# EAGLE design Esp_Companion_V1 (EAGLE 7.2.0)
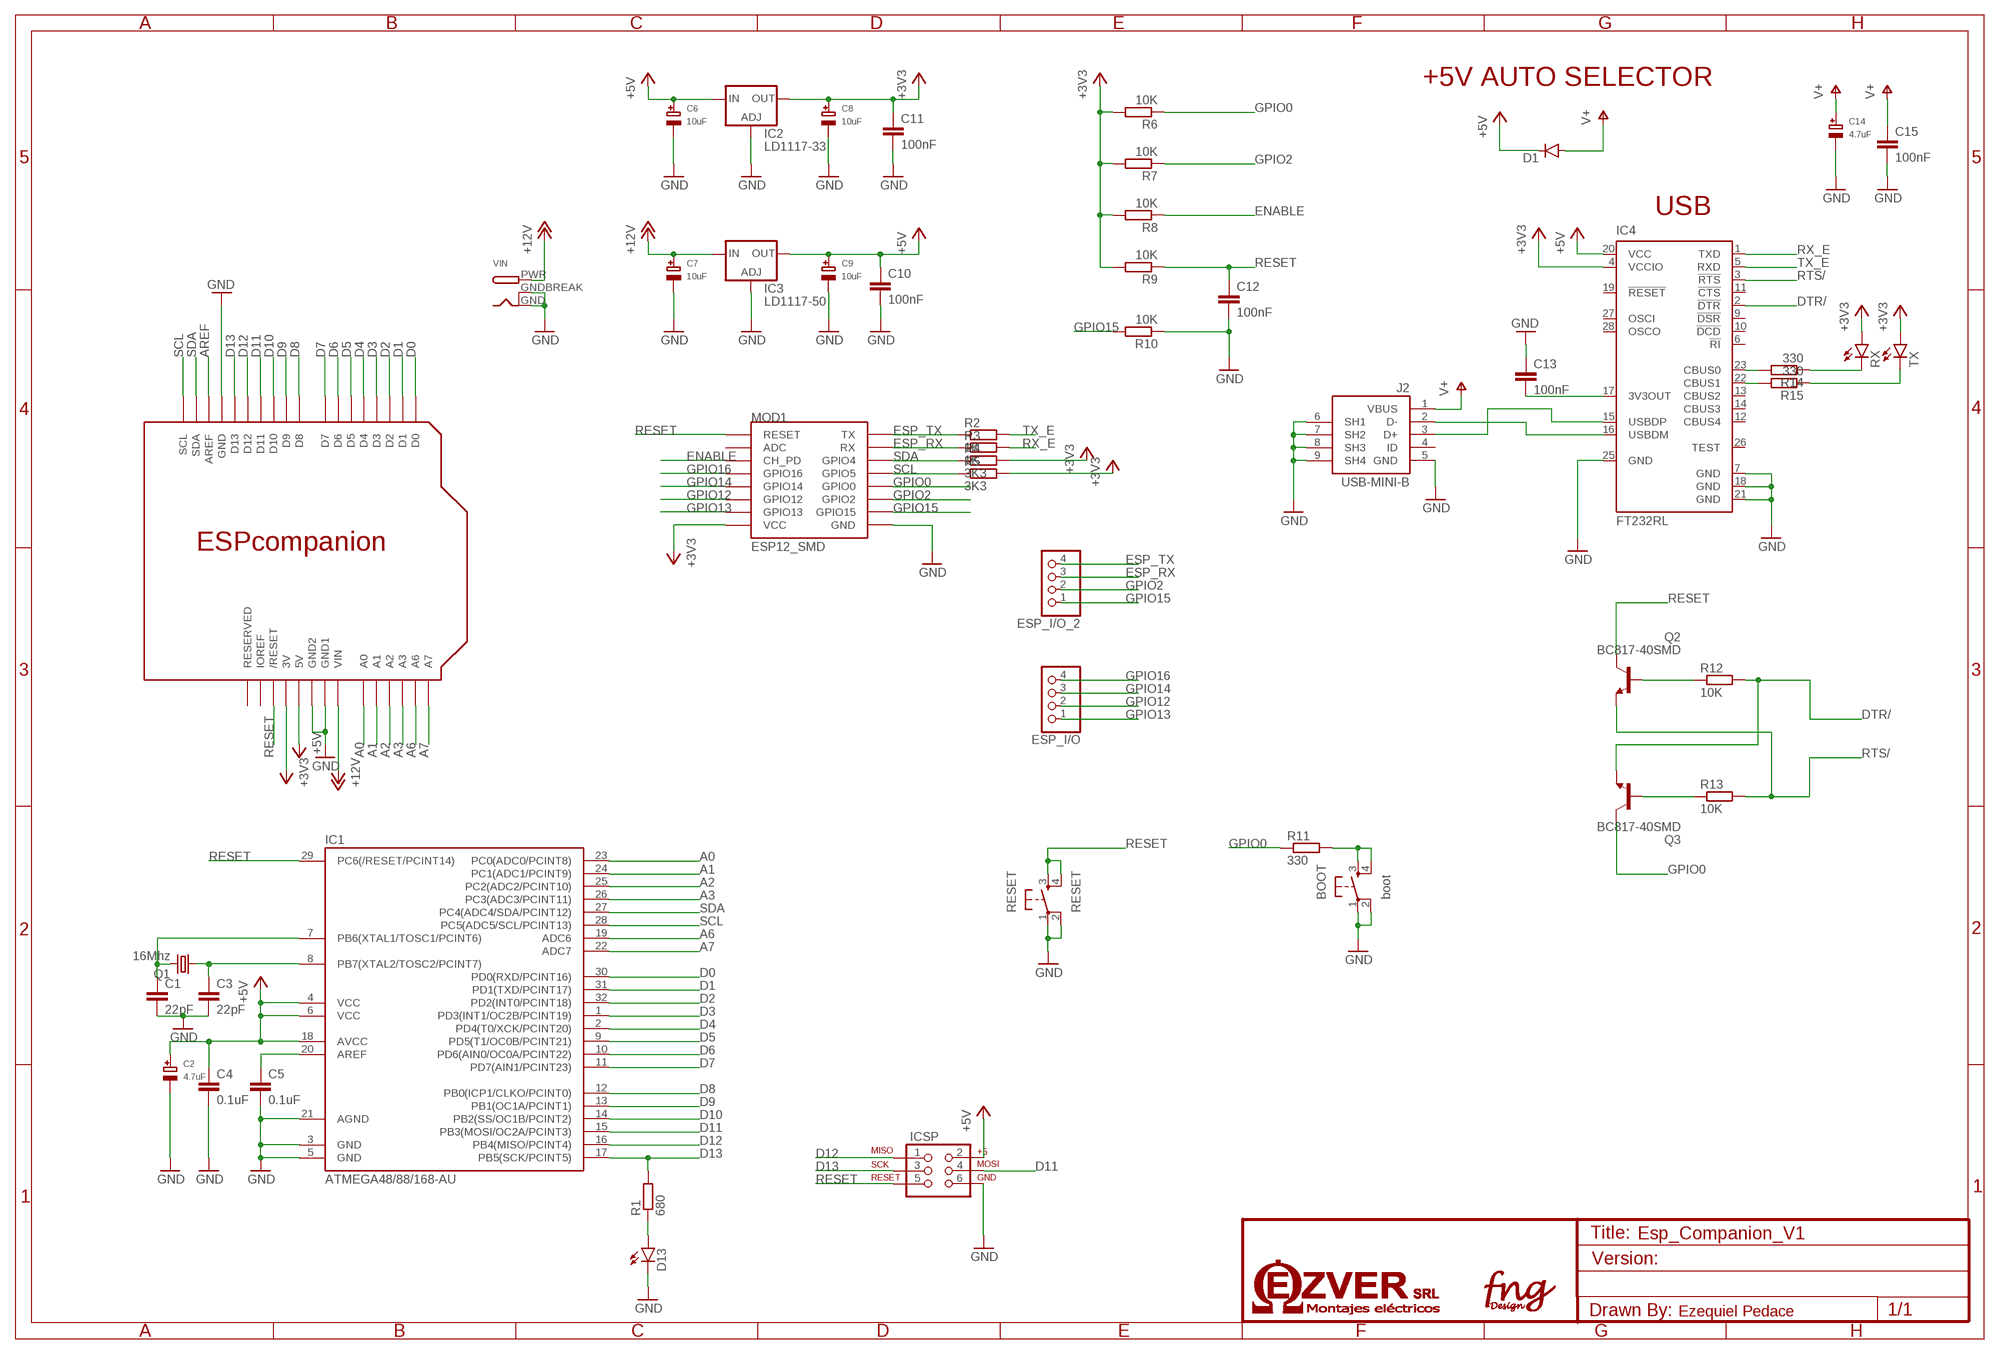
[diagram p0: schematic, sheet 1]

## Parts
BOOT  boot  TAC_SWITCHPTH  [TACTILE-PTH]
C1  22pF  C-EUC0603  [C0603]
C2  4.7uF  CAP_TANTALUMA/3216_REFLOW  [EIA3216-18/A-R]
C3  22pF  C-EUC0603  [C0603]
C4  0.1uF  C-EUC0603  [C0603]
C5  0.1uF  C-EUC0603  [C0603]
C6  10uF  CAP_TANTALUMA/3216_REFLOW  [EIA3216-18/A-R]
C7  10uF  CAP_TANTALUMA/3216_REFLOW  [EIA3216-18/A-R]
C8  10uF  CAP_TANTALUMA/3216_REFLOW  [EIA3216-18/A-R]
C9  10uF  CAP_TANTALUMA/3216_REFLOW  [EIA3216-18/A-R]
C10  100nF  C-EUC0603  [C0603]
C11  100nF  C-EUC0603  [C0603]
C12  100nF  C-EUC0603  [C0603]
C13  100nF  C-EUC0603  [C0603]
C14  4.7uF  CAP_TANTALUMA/3216_REFLOW  [EIA3216-18/A-R]
C15  100nF  C-EUC0603  [C0603]
D1  DIODESMA-ALT  [SMA-DIODE_ALT]
D13  LED-FKIT-1206  [FKIT-LED-1206]
ESP_I/O  PINHD-1X4  [1X04]
ESP_I/O_2  PINHD-1X4  [1X04]
IC1  ATMEGA48/88/168-AU  [TQFP32-08]
IC2  LD1117-33  LD117ADT33TR  [DPACK]
IC3  LD1117-50  LD117ADT33TR  [DPACK]
IC4  FT232RL  [SSOP28]
ICSP  AVR_SPI_PRG_62X3_LOCK  [2X3_LOCK]
J2  USB-MINI-B  [USB-MINI-B]
LAY1  ESPCOMPANIONHOLES  [ESPCOMPANION_HOLES]
MOD1  ESP12_SMD  [ESP12_SMD]
Q1  16Mhz  CRYSTALHC49U70  [HC49U70]
Q2  BC817-40SMD  [SOT23-BEC]
Q3  BC817-40SMD  [SOT23-BEC]
R1  680  R-EU_R0603  [R0603]
R2  1K  R-EU_R0603  [R0603]
R3  1K  R-EU_R0603  [R0603]
R4  3K3  R-EU_R0603  [R0603]
R5  3K3  R-EU_R0603  [R0603]
R6  10K  R-EU_R0603  [R0603]
R7  10K  R-EU_R0603  [R0603]
R8  10K  R-EU_R0603  [R0603]
R9  10K  R-EU_R0603  [R0603]
R10  10K  R-EU_R0603  [R0603]
R11  330  R-EU_R0603  [R0603]
R12  10K  R-EU_R0603  [R0603]
R13  10K  R-EU_R0603  [R0603]
R14  330  R-EU_R0603  [R0603]
R15  330  R-EU_R0603  [R0603]
RESET  RESET  TAC_SWITCHPTH  [TACTILE-PTH]
RX  LED-FKIT-1206  [FKIT-LED-1206]
TX  LED-FKIT-1206  [FKIT-LED-1206]
VIN  DCBARRELPTH  [DCJACK_2MM_PTH]

## Nets
+3V3: C8.+ C11.1 IC2.4(OUT) IC4.4(VCCIO) LAY1.3V MOD1.P$8(VCC) R4.2 R5.2 R6.2 R7.2 R8.2 R9.2 RX.A TX.A
+5V: C2.+ C4.1 C6.+ C9.+ C10.1 D1.C IC1.4(VCC) IC1.6(VCC) IC1.18(AVCC) IC2.3(IN) IC3.4(OUT) IC4.20(VCC) ICSP.2 LAY1.5V
+12V: C7.+ IC3.3(IN) LAY1.VIN VIN.PWR
A0: IC1.23(PC0(ADC0/PCINT8)) LAY1.A0
A1: IC1.24(PC1(ADC1/PCINT9)) LAY1.A1
A2: IC1.25(PC2(ADC2/PCINT10)) LAY1.A2
A3: IC1.26(PC3(ADC3/PCINT11)) LAY1.A3
A6: IC1.19(ADC6) LAY1.A6
A7: IC1.22(ADC7) LAY1.A7
AREF: LAY1.AREF
D0: IC1.30(PD0(RXD/PCINT16)) LAY1.D0
D1: IC1.31(PD1(TXD/PCINT17)) LAY1.D1
D2: IC1.32(PD2(INT0/PCINT18)) LAY1.D2
D3: IC1.1(PD3(INT1/OC2B/PCINT19)) LAY1.D3
D4: IC1.2(PD4(T0/XCK/PCINT20)) LAY1.D4
D5: IC1.9(PD5(T1/OC0B/PCINT21)) LAY1.D5
D6: IC1.10(PD6(AIN0/OC0A/PCINT22)) LAY1.D6
D7: IC1.11(PD7(AIN1/PCINT23)) LAY1.D7
D8: IC1.12(PB0(ICP1/CLKO/PCINT0)) LAY1.D8
D9: IC1.13(PB1(OC1A/PCINT1)) LAY1.D9
D10: IC1.14(PB2(SS/OC1B/PCINT2)) LAY1.D10
D11: IC1.15(PB3(MOSI/OC2A/PCINT3)) ICSP.4 LAY1.D11
D12: IC1.16(PB4(MISO/PCINT4)) ICSP.1 LAY1.D12
D13: IC1.17(PB5(SCK/PCINT5)) ICSP.3 LAY1.D13 R1.2
DTR/: IC4.2(!DTR) Q3.E R12.2
ENABLE: MOD1.P$3(CH_PD) R8.1
ESP_RX: ESP_I/O_2.3 MOD1.P$15(RX) R3.1
ESP_TX: ESP_I/O_2.4 MOD1.P$16(TX) R2.1
GND: BOOT.1 BOOT.2 C1.2 C2.- C3.2 C4.2 C5.2 C6.- C7.- C8.- C9.- C10.2 C11.2 C12.2 C13.1 C14.- C15.2 D13.C IC1.3(GND) IC1.5(GND) IC1.21(AGND) IC2.1(ADJ) IC3.1(ADJ) IC4.7(GND) IC4.18(GND) IC4.21(GND) IC4.25(GND) ICSP.6 J2.5(GND) J2.6(SH1) J2.7(SH2) J2.8(SH3) J2.9(SH4) LAY1.GND LAY1.GND1 LAY1.GND2 MOD1.P$9(GND) R10.1 RESET.1 RESET.2 VIN.GND VIN.GNDBREAK
GPIO0: MOD1.P$12(GPIO0) Q3.C R6.1 R11.1
GPIO2: ESP_I/O_2.2 MOD1.P$11(GPIO2) R7.1
GPIO12: ESP_I/O.2 MOD1.P$6(GPIO12)
GPIO13: ESP_I/O.1 MOD1.P$7(GPIO13)
GPIO14: ESP_I/O.3 MOD1.P$5(GPIO14)
GPIO15: ESP_I/O_2.1 MOD1.P$10(GPIO15) R10.2
GPIO16: ESP_I/O.4 MOD1.P$4(GPIO16)
N$1: D13.A R1.1
N$2: BOOT.3 BOOT.4 R11.2
N$3: Q2.B R12.1
N$4: Q3.B R13.1
N$25: C3.1 IC1.8(PB7(XTAL2/TOSC2/PCINT7)) Q1.1
N$28: C1.1 IC1.7(PB6(XTAL1/TOSC1/PCINT6)) Q1.2
N$29: C5.1 IC1.20(AREF)
N$40: C13.2 IC4.17(3V3OUT)
N$42: IC4.23(CBUS0) R14.2
N$43: IC4.22(CBUS1) R15.2
N$44: R15.1 TX.C
N$45: R14.1 RX.C
N$46: IC4.16(USBDM) J2.2(D-)
N$47: IC4.15(USBDP) J2.3(D+)
RESET: C12.1 IC1.29(PC6(/RESET/PCINT14)) ICSP.5 LAY1.RESET(/RESET) MOD1.P$1(RESET) Q2.C R9.1 RESET.3 RESET.4
RTS/: IC4.3(!RTS) Q2.E R13.2
RX_E: IC4.1(TXD) R3.2
SCL: IC1.28(PC5(ADC5/SCL/PCINT13)) LAY1.SCL MOD1.P$14(GPIO5) R5.1
SDA: IC1.27(PC4(ADC4/SDA/PCINT12)) LAY1.SDA MOD1.P$13(GPIO4) R4.1
TX_E: IC4.5(RXD) R2.2
V+: C14.+ C15.1 D1.A J2.1(VBUS)
Unconnected: IC4.6(!RI) IC4.9(!DSR) IC4.10(!DCD) IC4.11(!CTS) IC4.12(CBUS4) IC4.13(CBUS2) IC4.14(CBUS3) IC4.19(!RESET) IC4.26(TEST) IC4.27(OSCI) IC4.28(OSCO) J2.4(ID) LAY1.IOREF LAY1.RESERVED MOD1.P$2(ADC)

## Notes on the sheet
- +5V AUTO SELECTOR
- USB

## Library data of the parts
BOOT RESET = SparkFun-Electromechanical:TAC_SWITCH: Momentary Switch Button commonly used for reset or general input. Spark Fun Electronics SKU : COM-00097
C1 C3-C5 C10-C13 C15 = rcl:C-EU: CAPACITOR, European symbol
C2 C6-C9 C14 = microbuilder:CAP_TANTALUM: Tantalum Capacitors Wave footprints have larger pads and are meant to be used for hand soldering. Reflow footprints are optimised for solder paste and a reflow oven. EIA3216-18/A-[R/W] - Size A / 3216-18 / 1206 footprint 4.7µF 25V 10% Tantalum Capacitor 10µF 16V 10% Tantalum Capacitor [Digikey: 495-2236-2-ND] EIA3528-21/B-[R/W] - Size B / 3528-21 47µF 10V 10% Tantalum Capactior [Digikey: 495-2216-1-ND] EIA6032-28/C-[R/W] - Size C / 6032-28 10µF 35V 20% Tantalum Capacitor [Digikey: 495-2285-1-ND] 100µF 16V 10% Tantalum Capactior [Digikey: 399-5214-1-ND]
D1 = SparkFun-DiscreteSemi:DIODE: Diode These are standard reverse protection diodes and small signal diodes. SMA package can handle up to about 1A. SOD-323 can handle about 200mA. What the SOD-323 package when ordering, there are some mfgs out there that are 5-pin packages.
D13 RX TX = SparkFun-LED:LED: LEDs Standard schematic elements and footprints for 5mm, 3mm, 1206, and 0603 sized LEDs. 5mm - Spark Fun Electronics SKU : COM-00529 (and others)
ESP_I/O ESP_I/O_2 = pinhead:PINHD-1X4: PIN HEADER
IC1 = atmega8:ATMEGA48/88/168
IC2 IC3 = v-reg:LD117A?*: Low drop fixed and adjustable positive voltage regulators 1 A Source: http://www.st.com/stonline/products/literature/ds/7194/ld1117axx.pdf
IC4 = ftdichip:FT232R: Source: http://www.ftdichip.com/Documents/DataSheets/DS_FT232R_v104.pdf; MPN: FT232RL; OC_FARNELL: 1146032; OC_NEWARK: 91K9918
ICSP = SparkFun-Connectors:AVR_SPI_PRG_6: AVR ISP 6 Pin This is the reduced ISP connector for AVR programming. Common on Arduino. This footprint will take up less PCB space and can be used with a 10-pin to 6-pin adapter such as SKU: BOB-08508 **Special note about "TEST_POINT" package. The stop mask is on the top side, so if you want your programming test points to be on the bottom of your board, make sure to place this package on the bottom side of the board. This also ensure that the orientation to program from the bottom side will be correct.
J2 = MyCON:USB-MINI-B
LAY1 = fng:ESPCOMPANION
MOD1 = esp8266modules:ESP12_SMD
Q1 = crystal:CRYSTAL: CRYSTAL; OC_FARNELL: unknown; OC_NEWARK: unknown
Q2 Q3 = transistor-npn:BC817*: NPN Transistor
R1-R15 = rcl:R-EU_: RESISTOR, European symbol
VIN = adafruit:DCBARREL: 2.0mm DC Barrel Jack DCJACK_2MM_PTH - Through Hole Jack (4UConnector: 05537)

## Board
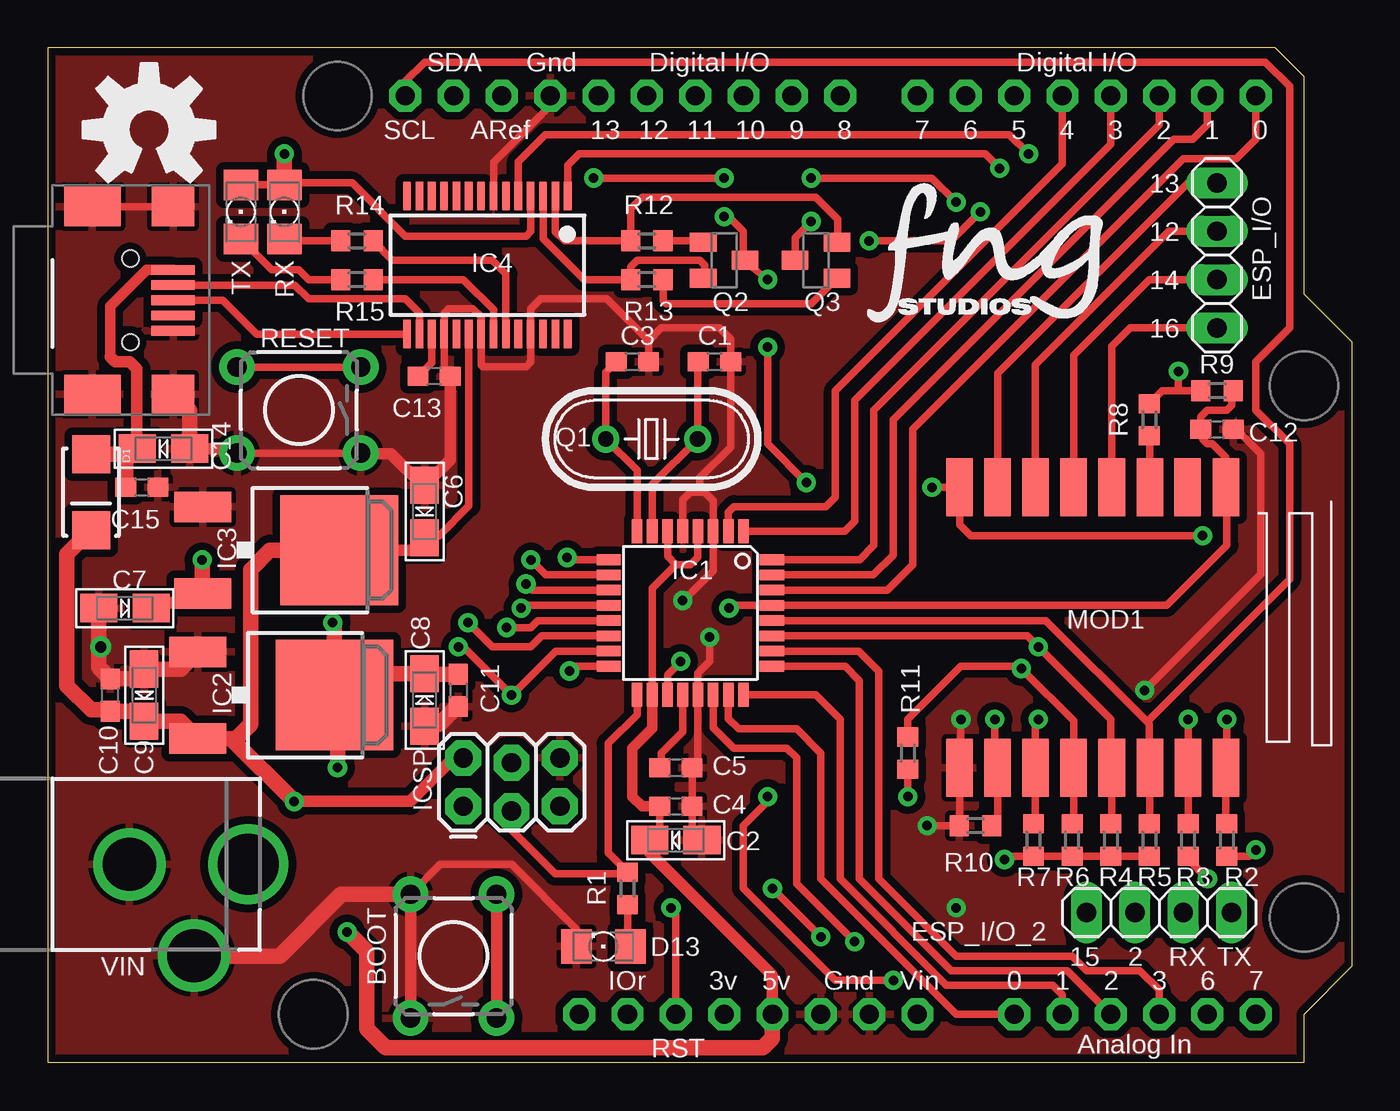
[diagram p1: board, top side]
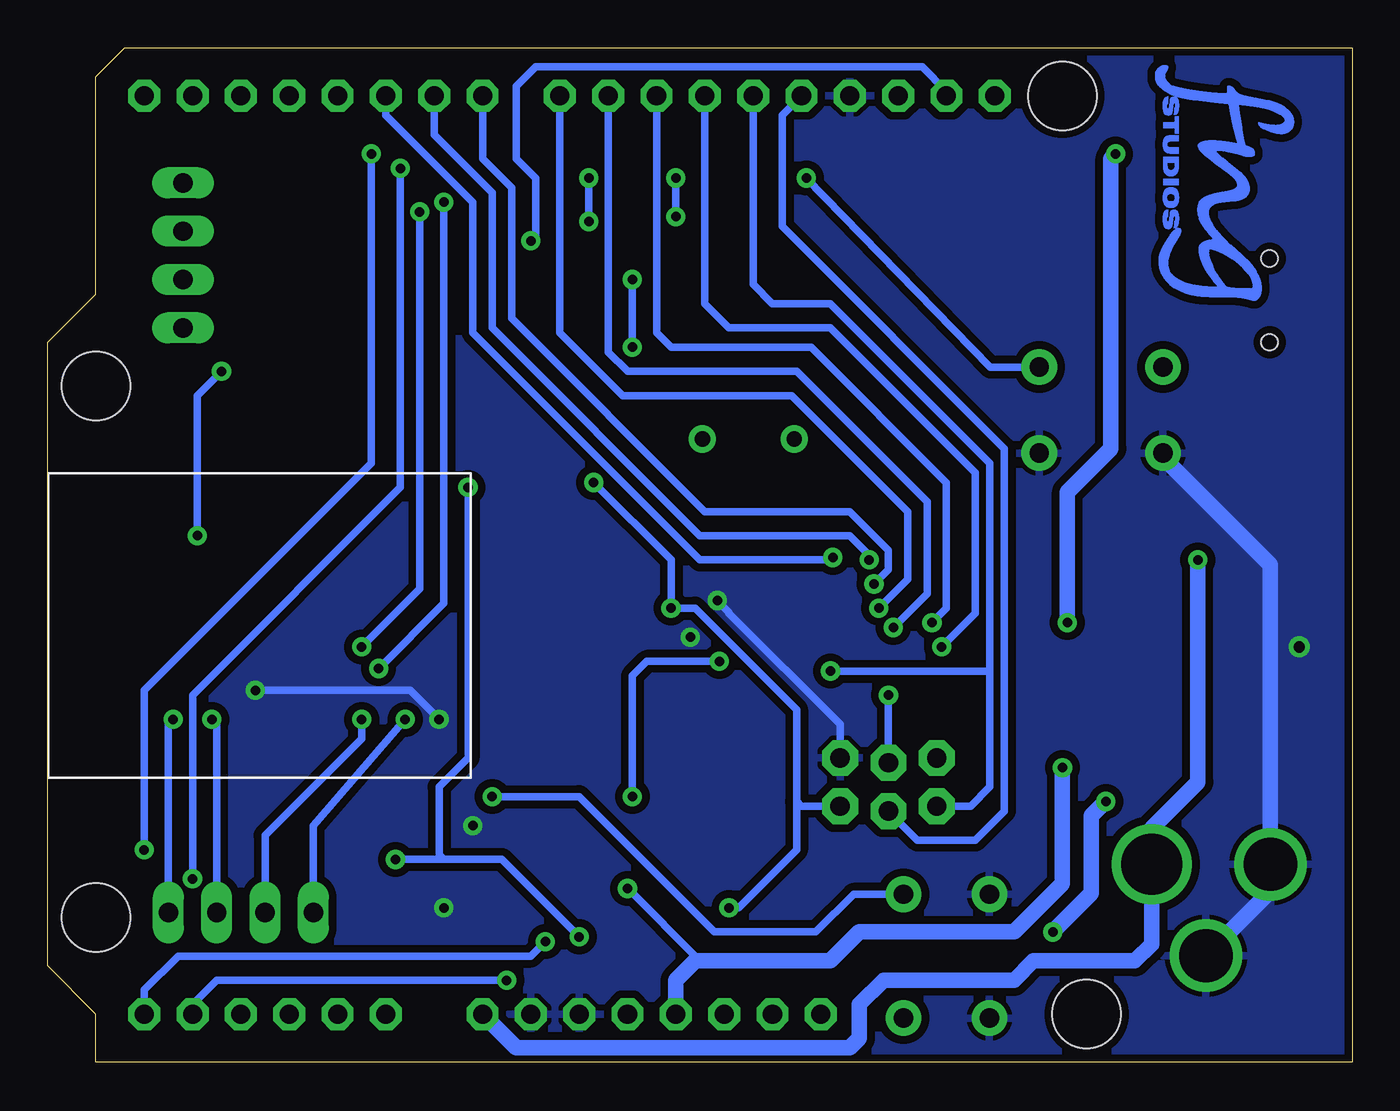
[diagram p2: board, bottom side, seen from below]

Size 68.58 x 53.34 mm. Coordinates in mm from the lower left corner, seen from the top.
Copper layers (1*16): Top 0.035mm / dielectric 1.5mm / Bottom 0.035mm
Design rules "SparkFun": minimum track width 8mil, minimum drill 20mil, track to track 8mil, track to pad 8mil, pad to pad 8mil, via to via 8mil, smd to smd 8mil, copper to edge 10mil, drill to drill 8mil, minimum pad ring 12mil, minimum via ring 10mil, stop-mask expansion 4mil, vias tented up to drill 25mil, thermal gap 10mil

### Footprints (pad centres in the part's own frame; a part is rotated, then mirrored left to right if it is on the bottom)
TACTILE-PTH = drill 1.016 pad 1.88: 1 -3.251,2.261; 2 3.251,2.261; 3 -3.251,-2.261; 4 3.251,-2.261
C0603 = smd 1.1 x 1: 1 -0.85,0; 2 0.85,0
EIA3216-18/A-R = smd 1.95 x 1.5: + 1.375,0; - -1.375,0
SMA-DIODE_ALT = smd 2 x 2: A -2,0; C 2,0
FKIT-LED-1206 = smd 1.6 x 1.803: A -1.422,0; C 1.422,0
1X04 = drill 1.016 long: 1 -3.81,0; 2 -1.27,0; 3 1.27,0; 4 3.81,0
TQFP32-08 = smd 1.27 x 0.559: 1 -4.293,2.8; 2 -4.293,2; 3 -4.293,1.2; 4 -4.293,0.4; 5 -4.293,-0.4; 6 -4.293,-1.2; 7 -4.293,-2; 8 -4.293,-2.8; 17 4.293,-2.8; 18 4.293,-2; 19 4.293,-1.2; 20 4.293,-0.4; 21 4.293,0.4; 22 4.293,1.2; 23 4.293,2; 24 4.293,2.8 | smd 0.559 x 1.27: 9 -2.8,-4.293; 10 -2,-4.293; 11 -1.2,-4.293; 12 -0.4,-4.293; 13 0.4,-4.293; 14 1.2,-4.293; 15 2,-4.293; 16 2.8,-4.293; 25 2.8,4.293; 26 2,4.293; 27 1.2,4.293; 28 0.4,4.293; 29 -0.4,4.293; 30 -1.2,4.293; 31 -2,4.293; 32 -2.8,4.293
DPACK = smd 1.6 x 3: 1 -2.28,-4.8; 3 2.28,-4.8 | smd 5.8 x 6.2: 4 0,2.38
SSOP28 = smd 0.4 x 1.5: 1 -4.225,-3.625; 2 -3.575,-3.625; 3 -2.925,-3.625; 4 -2.275,-3.625; 5 -1.625,-3.625; 6 -0.975,-3.625; 7 -0.325,-3.625; 8 0.325,-3.625; 9 0.975,-3.625; 10 1.625,-3.625; 11 2.275,-3.625; 12 2.925,-3.625; 13 3.575,-3.625; 14 4.225,-3.625; 15 4.225,3.625; 16 3.575,3.625; 17 2.925,3.625; 18 2.275,3.625; 19 1.625,3.625; 20 0.975,3.625; 21 0.325,3.625; 22 -0.325,3.625; 23 -0.975,3.625; 24 -1.625,3.625; 25 -2.275,3.625; 26 -2.925,3.625; 27 -3.575,3.625; 28 -4.225,3.625
2X3_LOCK = drill 1.016 pad 1.88 octagon: 1 0,0; 2 0,2.54; 3 2.54,-0.254; 4 2.54,2.286; 5 5.08,0; 6 5.08,2.54
USB-MINI-B = smd 0.508 x 2.286: 1 0,0; 2 0.8,0; 3 1.6,0; 4 2.4,0; 5 3.2,0 | smd 2.057 x 2.235: 6 -3.328,0; 7 6.529,0 | smd 2.057 x 2.972: 8 -3.328,-4.25; 9 6.529,-4.25 | hole 0.864: -0.6,-2.25; 3.8,-2.25
ESPCOMPANION_HOLES = drill 1 pad 1.676 octagon: 3V 1.27,-24.13; 5V 3.81,-24.13; A0 16.51,-24.13; A1 19.05,-24.13; A2 21.59,-24.13; A3 24.13,-24.13; A6 26.67,-24.13; A7 29.21,-24.13; AREF -10.414,24.13; D0 29.21,24.13; D1 26.67,24.13; D2 24.13,24.13; D3 21.59,24.13; D4 19.05,24.13; D5 16.51,24.13; D6 13.97,24.13; D7 11.43,24.13; D8 7.366,24.13; D9 4.826,24.13; D10 2.286,24.13; D11 -0.254,24.13; D12 -2.794,24.13; D13 -5.334,24.13; GND -7.874,24.13; GND1 8.89,-24.13; GND2 6.35,-24.13; IOREF -3.81,-24.13; RESERVED -6.35,-24.13; RESET -1.27,-24.13; SCL -15.494,24.13; SDA -12.954,24.13; VIN 11.43,-24.13 | hole 3.6: -19.05,24.13; 31.75,8.89; 31.75,-19.05; -20.32,-24.13
ESP12_SMD = smd 3.048 x 1.397: P$1 -7.366,7.061; P$2 -7.366,5.055; P$3 -7.366,3.073; P$4 -7.366,1.067; P$5 -7.366,-0.94; P$6 -7.366,-2.946; P$7 -7.366,-4.928; P$8 -7.366,-6.934; P$9 7.366,-6.934; P$10 7.366,-4.928; P$11 7.366,-2.946; P$12 7.366,-0.94; P$13 7.366,1.067; P$14 7.366,3.073; P$15 7.366,5.08; P$16 7.366,7.061
HC49U70 = drill 0.813: 1 -2.413,0; 2 2.413,0
SOT23-BEC = smd 1 x 1.4: B -0.95,-1.1; C 0,1.1; E 0.95,-1.1
R0603 = smd 1 x 1.1: 1 -0.85,0; 2 0.85,0
DCJACK_2MM_PTH = drill 2.8: GND 0,7.35; GNDBREAK 4.8,10.75 | drill 3.2: PWR 0,13.6

### Placement (x,y rotation side)
BOOT  21.34,5.59 90 top
C1  35.05,36.83 0 top
C2  33.02,11.68 180 top
C3  30.73,36.83 0 top
C4  33.02,13.46 0 top
C5  33.02,15.49 0 top
C6  19.81,28.96 270 top
C7  4.06,23.88 0 top
C8  19.81,19.05 90 top
C9  5.08,19.3 270 top
C10  3.3,19.3 90 top
C11  21.59,19.56 270 top
C12  61.47,33.27 0 top
C13  20.32,36.07 180 top
C14  6.1,32.26 180 top
C15  4.95,30.23 0 top
D1  2.29,29.97 270 top
D13  29.21,6.1 180 top
ESP_I/O  61.47,42.42 270 top
ESP_I/O_2  58.42,7.87 0 top
IC1  33.78,23.62 270 top
IC2  12.7,19.3 270 top
IC3  12.95,26.92 270 top
IC4  23.11,41.91 180 top
ICSP  21.84,13.46 0 top
J2  6.6,41.66 270 top
LAY1  34.29,26.67 0 top
MOD1  54.86,22.86 270 top
Q1  31.75,32.77 0 top
Q2  35.56,42.16 270 top
Q3  40.39,42.16 90 top
R1  30.48,9.14 90 top
R2  61.98,11.68 270 top
R3  59.94,11.68 270 top
R4  55.88,11.68 270 top
R5  57.91,11.68 270 top
R6  53.85,11.68 270 top
R7  51.82,11.68 270 top
R8  57.91,33.78 90 top
R9  61.47,35.31 180 top
R10  48.77,12.45 0 top
R11  45.21,16.26 270 top
R12  31.5,43.18 180 top
R13  31.5,41.15 180 top
R14  16.26,43.18 0 top
R15  16.26,41.15 0 top
RESET  13.21,34.29 180 top
RX  12.45,44.7 270 top
TX  10.16,44.7 270 top
U$2  [LOGOFNGNAME1]  42.42,37.85 0 top
U$3  [LOGOFNG]  11.43,53.09 270 bottom
U$4  [OSHW-LOGO-L]  5.33,49.02 0 top
VIN  -3.05,10.41 270 top

### Tracks (layer width: path | path; a pad name or v marks a point on that pad's centre or on a via)
+3V3  (via drill 0.5)
  Top 0.406: R7.2 R6.2 R4.2 R5.2 50.46,10.83 v50.29,10.67 | TX.A RX.A 12.55,46.23 16,46.23 18.8,43.43 25.15,43.43 25.39,43.68 IC4.4 | R9.2 59.44,35.31 | 59.44,35.31 58.59,35.31 R8.2 | v60.71,27.69 48.51,27.69 47.93,28.27 MOD1.P$8 v46.48,30.23 | v59.44,36.32 59.44,35.31 | 19.81,21.08 C8.+ | 15.95,20.43 IC2.4 15.24,19.72 | v40.64,6.6 v38.1,9.14
  Top 0.813: 15.24,19.72 v15.24,15.49 | 15.95,20.43 C8.+ 19.83,20.41 C11.1 | IC2.4 15.08,22.77 v14.99,23.11 | v12.45,47.75 RX.A
  Bottom 0.406: v60.71,27.69 60.71,35.05 v59.44,36.32 | v50.29,10.67 47.75,10.67 | 47.75,10.67 44.7,10.67 v40.64,6.6 | v38.1,9.14 34.29,5.33 | v46.48,30.23 46.48,16 48.01,14.48 48.01,10.92 47.75,10.67
  Bottom 0.813: v15.24,15.49 15.24,9.4 17.78,6.86 25.91,6.86 27.43,5.33 34.29,5.33 34.54,5.33 35.56,4.32 LAY1.3V | v14.99,23.11 14.99,29.97 12.7,32.26 12.7,47.5 v12.45,47.75
+5V  (via drill 0.5)
  Top 0.406: C4.1 32.17,12.21 C2.+ | IC4.20 22.14,29.25 20.57,27.69 19.92,27.69 C6.+ | IC1.6 32.58,26.6 33.02,26.16 | IC1.4 34.18,26.56 33.78,26.16 33.02,26.16 | IC1.18 31.78,24.92 33.02,26.16
  Top 0.559: IC1.18 31.78,17.56 30.73,16.51 30.73,13.97 31.24,13.46 C4.1
  Top 0.61: IC3.4 19.16,26.92 C6.+ | ICSP.2 21.34,16 19.05,13.72 v12.96,13.72 | C2.+ 31.64,11.03 38.1,4.57 LAY1.5V
  Top 0.813: 9.65,17.02 IC2.3 7,17.93 C9.+ 4.55,18.45 C10.1 3.21,18.54 2.29,18.54 1.02,19.81 1.02,26.7 D1.C | 9.65,17.02 9.91,17.02 10.67,17.78 10.67,25.91 11.68,26.92 IC3.4 | LAY1.5V 38.1,1.27 37.59,0.76 17.78,0.76 16.76,1.78 16.76,5.84 v15.75,6.86 | v12.96,13.72 9.65,17.02
  Bottom 0.813: v15.75,6.86 13.72,8.89 13.72,12.96 v12.96,13.72
+12V  (via drill 0.5)
  Top 0.61: IC3.3 C7.+
  Top 0.813: v8.13,26.42 8.13,24.67 IC3.3
  Bottom 0.813: LAY1.VIN 43.94,0.76 26.42,0.76 25.91,1.27 25.91,3.05 24.64,4.32 17.78,4.32 16.76,5.33 11.43,5.33 10.55,6.21 VIN.PWR 10.55,12.31 8.13,14.73 v8.13,26.42
A0
  Top 0.406: IC1.23 35.78,18.07 36.32,17.53 39.37,17.53 40.64,16.26 40.64,9.65 47.75,2.54 LAY1.A0
A1
  Top 0.406: IC1.24 40.36,19.33 41.66,18.03 41.66,9.65 47.24,4.06 52.83,4.06 53.34,3.56 LAY1.A1
A2
  Top 0.406: IC1.25 41.92,20.82 42.67,20.07 42.67,9.65 47.5,4.83 53.59,4.83 LAY1.A2
A3
  Top 0.406: IC1.26 42.64,21.62 43.69,20.57 43.69,9.65 47.75,5.59 53.85,5.59 54.61,4.83 57.4,4.83 58.42,3.81 LAY1.A3
A6  (via drill 0.5)
  Top 0.406: IC1.19 32.58,20.39 v33.27,21.08 | v37.85,13.97 37.85,13.72 36.58,12.45 36.58,9.14 41.4,4.32 v44.45,4.32
  Bottom 0.406: v33.27,21.08 37.08,21.08 37.85,20.32 v37.85,13.97 | LAY1.A6 60.96,3.05 59.69,4.32 v44.45,4.32
A7  (via drill 0.5)
  Top 0.406: IC1.22 34.98,17.6 36.07,16.51 38.86,16.51 39.37,16 39.37,9.4 v42.42,6.35
  Bottom 0.406: LAY1.A7 63.5,3.81 61.72,5.59 43.18,5.59 v42.42,6.35
D0
  Top 0.406: IC1.30 44.13,24.82 45.47,26.16 45.47,33.27 59.69,47.5 62.48,47.5 63.5,48.51 LAY1.D0
D1
  Top 0.406: IC1.31 43.4,25.62 44.45,26.67 44.45,33.78 59.18,48.51 60.2,48.51 60.96,49.28 LAY1.D1
D2
  Top 0.406: IC1.32 42.68,26.42 43.43,27.18 43.43,34.29 58.42,49.28 LAY1.D2
D3
  Top 0.406: IC1.1 41.88,27.91 42.42,28.45 42.42,34.8 55.88,48.26 LAY1.D3
D4
  Top 0.406: IC1.2 35.78,28.92 36.07,29.21 40.89,29.21 41.4,29.72 41.4,35.31 53.34,47.24 LAY1.D4
D5  (via drill 0.5)
  Top 0.406: IC1.9 27.43,26.42 v27.3,26.54
  Bottom 0.406: LAY1.D5 50.8,49.78 46.23,45.21 46.23,38.35 34.29,26.42 27.43,26.42 v27.3,26.54
D6  (via drill 0.5)
  Top 0.406: IC1.10 26.19,25.62 v25.4,26.42
  Bottom 0.406: LAY1.D6 48.26,48.77 45.21,45.72 45.21,38.61 34.29,27.69 26.42,27.69 25.53,26.8 v25.4,26.42
D7  (via drill 0.5)
  Top 0.406: IC1.11 25.47,24.82 v25.15,25.15
  Bottom 0.406: LAY1.D7 45.72,47.5 44.2,45.97 44.2,39.12 34.04,28.96 26.42,28.96 24.38,26.92 24.38,25.91 v25.15,25.15
D8  (via drill 0.5)
  Top 0.406: IC1.12 25.04,24.02 v24.89,23.88
  Bottom 0.406: LAY1.D8 41.66,38.35 38.35,35.05 29.46,35.05 23.37,28.96 23.37,25.4 v24.89,23.88
D9  (via drill 0.5)
  Top 0.406: IC1.13 25.76,23.22 25.4,22.86 v24.13,22.86
  Bottom 0.406: LAY1.D9 39.12,37.34 38.1,36.32 29.21,36.32 22.35,29.46 22.35,24.64 v24.13,22.86
D10  (via drill 0.5)
  Top 0.406: IC1.14 25.98,22.42 25.4,21.84 23.37,21.84 v22.1,23.11
  Bottom 0.406: LAY1.D10 36.58,38.35 35.81,37.59 28.45,37.59 21.34,30.48 21.34,23.88 v22.1,23.11
D11  (via drill 0.5)
  Top 0.406: IC1.15 26.7,21.62 v24.38,19.3 21.84,21.84 v21.59,21.84
  Bottom 0.406: v24.38,19.3 ICSP.4 | LAY1.D11 34.04,39.88 32.77,38.61 27.43,38.61 19.81,30.99 19.81,23.62 v21.59,21.84
D12  (via drill 0.5)
  Top 0.406: IC1.16 27.69,20.82 v27.43,20.57
  Bottom 0.406: v27.43,20.57 19.05,20.57 | 19.05,20.57 19.05,14.48 20.07,13.46 ICSP.1 | LAY1.D12 31.5,40.89 30.48,39.88 27.43,39.88 19.05,31.5 19.05,20.57
D13
  Top 0.406: IC1.17 30.98,18.28 29.46,16.76 29.46,11.01 R1.2 30.39,9.91 26.67,9.91 24.38,12.19 ICSP.3
  Bottom 0.406: ICSP.3 22.86,11.68 19.81,11.68 18.29,13.21 18.29,32.26 29.97,43.94 29.97,49.78 LAY1.D13
DTR/
  Top 0.406: IC4.2 26.69,43.67 27.18,43.18 R12.2 30.65,44.87 31.24,45.47 40.39,45.47 41.53,44.32 41.53,43.16 Q3.E
ENABLE
  Top 0.406: MOD1.P$3 57.94,32.91 R8.1
ESP_RX  (via drill 0.5)
  Top 0.406: R3.1 MOD1.P$15 v59.94,18.03
  Bottom 0.406: ESP_I/O_2.3 59.69,17.78 v59.94,18.03
ESP_TX  (via drill 0.5)
  Top 0.406: R2.1 61.92,12.59 MOD1.P$16 61.98,15.54 v61.98,18.03
  Bottom 0.406: ESP_I/O_2.4 62.23,17.78 v61.98,18.03
GND  (via drill 0.5, 0.6)
  Top 0.406: C3.2 31.58,37.93 | 31.58,37.93 32.26,38.61 35.31,38.61 35.9,38.01 C1.2 35.9,32.35 34.29,30.73 34.29,29.97 | J2.8 J2.6 | R10.1 MOD1.P$9 48.01,15.57 v48.01,18.03 | 48.01,12.36 R10.1 | C2.- 33.87,12.21 C4.2 C5.2 34.18,15.81 IC1.21 34.18,20.47 34.8,21.08 v34.8,22.35 | IC4.7 23.44,47.31 26.42,50.29 LAY1.GND | C13.1 20.84,36.4 IC4.18 20.84,39.38 21.08,39.62 22.35,39.62 22.79,39.19 IC4.21 22.79,36.65 22.86,36.58 25.15,36.58 25.4,36.83 IC4.25 25.39,39.61 25.91,40.13 29.39,40.13 31.58,37.93 | RESET.2 RESET.1 | IC1.5 33.38,29.57 33.78,29.97 34.29,29.97 | 34.29,29.97 34.54,29.97 34.98,29.53 IC1.3 34.98,25.84 33.42,24.28 v33.38,24.28 | D13.C 27.79,7.01 24.38,10.41 20.65,10.41 BOOT.2 | R10.1 v46.23,12.45 | C12.2 62.48,33.27 63.75,32 63.75,25.65 v57.66,19.56
  Top 0.61: C14.- 9.73,32.26 RESET.2 | RESET.1 16.48,32 18.03,32 19.71,30.33 C6.- 21.17,31.69 C13.1 | BOOT.1 BOOT.2
  Top 0.813: IC2.1 7,20.68 C9.- 4.55,20.15 C10.2 2.69,20.77 C7.- 3.3,23.88 | 6.71,35.02 J2.7 7.47,34.26 C14.- 7.47,31.89 | C11.2 21.5,18.71 20.57,17.78 19.92,17.78 C8.- | BOOT.2 15.44,8.84 12.19,5.59 7.73,5.59 VIN.GNDBREAK
  Bottom 0.406: ICSP.6 26.92,17.78 32.77,23.62 | 32.77,23.66 v33.38,24.28 | v57.66,19.56 49.53,19.56 v48.01,18.03
  Bottom 0.813: RESET.2 9.96,31.8 4.32,26.16 4.32,10.43 | 4.32,10.43 VIN.GND | 4.32,10.43 4.32,9 VIN.GNDBREAK
  other vias: 47.75,8.13 2.79,21.84
  pour Bottom (isolate 0.406): 0.25,53.09 64.26,53.09 65.79,51.56 65.79,40.13 68.33,37.59 68.33,5.08 65.79,2.54 65.79,0.25 0.25,0.25
  pour Top (isolate 0.406): 0.25,53.09 64.26,53.09 65.79,51.56 65.79,40.13 68.33,37.59 68.33,5.08 65.79,2.54 65.79,0.25 0.25,0.25
GPIO0  (via drill 0.5)
  Top 0.406: R6.1 53.92,12.61 MOD1.P$12 53.92,17.96 51.31,20.57 v51.18,20.7 51.05,20.83 48.01,20.83 45.21,18.03 R11.1 | Q3.C 39.29,43.35 v40.13,44.2 | v40.13,46.48 46.48,46.48 v47.75,45.21
  Bottom 0.406: v40.13,44.2 v40.13,46.48 | v47.75,45.21 47.75,24.13 v51.18,20.7
GPIO2  (via drill 0.5)
  Top 0.406: R7.1 51.92,12.64 MOD1.P$11 51.92,17.88 v52.07,18.03
  Bottom 0.406: v52.07,18.03 52.07,17.02 57.15,11.94 ESP_I/O_2.2
GPIO12
  Top 0.406: MOD1.P$6 51.92,36.68 58.93,43.69 ESP_I/O.2
GPIO13
  Top 0.406: MOD1.P$7 49.94,36.22 59.94,46.23 ESP_I/O.1
GPIO14
  Top 0.406: MOD1.P$5 53.92,37.16 57.91,41.15 ESP_I/O.3
GPIO15  (via drill 0.5)
  Top 0.406: MOD1.P$10 49.94,14.99 | 49.94,14.99 49.94,12.76 R10.2 | v49.78,18.03 49.78,15.14 49.94,14.99
  Bottom 0.406: ESP_I/O_2.1 54.61,12.45 v49.78,18.03
GPIO16
  Top 0.406: MOD1.P$4 55.93,37.64 56.9,38.61 ESP_I/O.4
N$1
  Top 0.406: R1.1 30.48,6.25 D13.A
N$2  (via drill 0.5)
  Top 0.406: R11.2 v45.21,13.97
  Top 0.61: BOOT.3 BOOT.4
  Bottom 0.406: BOOT.4 26.21,8.84 28.19,6.86 33.53,6.86 40.64,13.97 v45.21,13.97
N$3
  Top 0.406: R12.1 34.39,43.18 Q2.B
N$4
  Top 0.406: R13.1 32.35,40.04 32.51,39.88 40.15,39.88 Q3.B
N$25
  Top 0.406: C3.1 29.34,36.28 Q1.1 30.98,31.12 IC1.8
N$28
  Top 0.406: C1.1 34.16,36.79 Q1.2 31.78,30.39 IC1.7
N$29
  Top 0.406: IC1.20 33.38,17.38 32.26,16.26 32.26,15.58 C5.1
N$40
  Top 0.406: IC4.17 20.19,36.79 C13.2
N$42
  Top 0.406: IC4.23 24.09,41.44 23.37,42.16 18.12,42.16 R14.2
N$43
  Top 0.406: IC4.22 23.44,39.55 21.84,41.15 R15.2
N$44
  Top 0.406: R15.1 13.72,41.15 13.21,41.66 11.79,41.66 TX.C
N$45
  Top 0.406: R14.1 12.55,43.18 RX.C
N$46
  Top 0.406: J2.2 12.99,40.86 13.72,40.13 18.8,40.13 19.56,39.37 19.56,38.3 IC4.16
N$47
  Top 0.406: IC4.15 10.99,38.28 9.22,40.06 J2.3
RESET  (via drill 0.5)
  Top 0.406: R9.1 62.23,35.22 62.23,34.54 61.98,34.29 60.96,34.29 60.62,33.95 C12.1 60.71,33.19 60.71,32.77 60.96,32.51 61.21,32.51 61.92,31.8 MOD1.P$1 61.98,30.18 61.98,27.18 58.82,24.02 IC1.29 35.96,24.02 v35.81,23.88 | RESET.4 RESET.3 | LAY1.RESET 33.02,7.87 v32.77,8.13 | v37.85,41.15 36.58,42.16 Q2.C 36.58,42.25 36.58,43.69 35.81,44.45 v35.56,44.45 | v37.85,37.59 37.85,32.51 v39.88,30.48 | v28.7,46.48 v35.56,46.48
  Bottom 0.406: v32.77,8.13 32.26,8.13 29.21,11.18 29.21,13.72 | v37.85,41.15 v37.85,37.59 | v39.88,30.48 35.81,26.42 v35.81,23.88 34.54,23.88 29.21,18.54 29.21,13.72 | RESET.3 19.02,36.55 v28.7,46.48 | v35.56,46.48 v35.56,44.45 | ICSP.5 28.96,13.46 29.21,13.72
RTS/
  Top 0.406: IC4.3 26.04,43.3 28.19,41.15 R13.2 30.65,41.82 30.99,42.16 34.29,42.16 34.54,41.91 34.54,41.3 Q2.E
RX_E  (via drill 0.5)
  Top 0.406: IC4.1 27.34,47.15 27.94,47.75 49.28,47.75 v50.04,46.99 | R3.2 59.94,10.67 v60.96,9.65
  Bottom 0.406: v50.04,46.99 50.04,30.23 60.96,19.3 v60.96,9.65
SCL
  Top 0.406: R5.1 57.94,12.56 MOD1.P$14 57.91,15.52 57.91,17.78 57.78,17.91 | IC1.28 52.47,23.22 57.78,17.91 | LAY1.SCL 18.8,51.56 19.81,52.58 64.01,52.58 65.28,51.31 65.28,38.61 63.5,36.83 63.5,34.29 65.28,32.51 65.28,25.4 57.78,17.91
SDA  (via drill 0.5)
  Top 0.406: 55.93,14.99 MOD1.P$13 55.88,15.54 55.88,18.03 v52.07,21.84 51.49,22.42 IC1.27 | 55.93,14.99 55.93,12.59 R4.1 | v43.18,43.18 47.5,43.18 v49.02,44.7 | 55.75,15.88 56.39,15.24 56.19,15.24 55.93,14.99
  Bottom 0.406: LAY1.SDA 21.34,51.05 22.61,52.32 42.93,52.32 43.94,51.31 43.94,47.5 42.93,46.48 42.93,43.43 v43.18,43.18 | v49.02,44.7 49.02,24.89 v52.07,21.84
TX_E  (via drill 0.5)
  Top 0.406: IC4.5 24.74,47.34 26.16,48.77 50.55,48.77 v51.56,47.75 | R2.2 63.16,10.83 v63.5,11.18
  Bottom 0.406: v51.56,47.75 51.56,31.5 63.5,19.56 v63.5,11.18
V+
  Top 0.559: J2.1 5.21,41.66 3.3,39.75 3.3,37.08
  Top 0.61: 3.3,37.08 3.56,36.83 4.32,36.83 4.7,36.45 4.7,33 C14.+
  Top 0.813: 4.07,30.19 C15.1 4.1,31.64 C14.+ 4.43,31.97 D1.A

### Text on the board
tNames: 13 | 12 | 14 | 16 | 15 | 2 | RX | TX